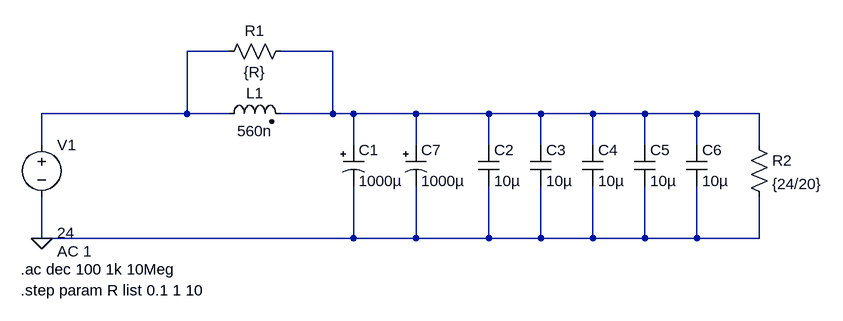
[diagram p0: schematic Output_FLT.asc]
Output_FLT.asc, the LTspice schematic file:
Version 4
SHEET 1 1068 680
WIRE 128 -80 64 -80
WIRE 288 -80 208 -80
WIRE 64 16 64 -80
WIRE 64 16 -160 16
WIRE 128 16 64 16
WIRE 288 16 288 -80
WIRE 288 16 208 16
WIRE 320 16 288 16
WIRE 416 16 320 16
WIRE 528 16 416 16
WIRE 608 16 528 16
WIRE 688 16 608 16
WIRE 768 16 688 16
WIRE 848 16 768 16
WIRE 944 16 848 16
WIRE -160 64 -160 16
WIRE 320 64 320 16
WIRE 416 64 416 16
WIRE 528 64 528 16
WIRE 608 64 608 16
WIRE 688 64 688 16
WIRE 768 64 768 16
WIRE 848 64 848 16
WIRE 944 64 944 16
WIRE -160 208 -160 144
WIRE 320 208 320 128
WIRE 320 208 -160 208
WIRE 416 208 416 128
WIRE 416 208 320 208
WIRE 528 208 528 128
WIRE 528 208 416 208
WIRE 608 208 608 128
WIRE 608 208 528 208
WIRE 688 208 688 128
WIRE 688 208 608 208
WIRE 768 208 768 128
WIRE 768 208 688 208
WIRE 848 208 848 128
WIRE 848 208 768 208
WIRE 944 208 944 144
WIRE 944 208 848 208
FLAG -160 208 0
SYMBOL voltage -160 48 R0
WINDOW 3 24 152 Left 2
WINDOW 123 24 180 Left 2
WINDOW 39 0 0 Left 0
SYMATTR Value 24
SYMATTR Value2 AC 1
SYMATTR InstName V1
SYMBOL ind2 112 32 R270
WINDOW 0 32 56 VTop 2
WINDOW 3 5 56 VBottom 2
SYMATTR InstName L1
SYMATTR Value 560n
SYMATTR Type ind
SYMATTR SpiceLine Ipk=23.5 Rser=0.0017 Rpar=327.9 Cpar=4.14p mfg="Würth Elektronik" pn="7843330056 WE-CHSA 1011"
SYMBOL res 112 -64 R270
WINDOW 0 32 56 VTop 2
WINDOW 3 0 56 VBottom 2
SYMATTR InstName R1
SYMATTR Value {R}
SYMBOL res 928 48 R0
SYMATTR InstName R2
SYMATTR Value {24/20}
SYMBOL polcap 304 64 R0
WINDOW 3 24 56 Left 2
SYMATTR InstName C1
SYMATTR Value 1000µ
SYMATTR Description Capacitor
SYMATTR Type cap
SYMATTR SpiceLine V=63 Irms=2.5 Rser=0.0297 Lser=16.4n mfg="Würth Elektronik" pn="860040780017 WCAP-ATUL 16x35,5" type="Al electrolytic"
SYMBOL cap 512 64 R0
SYMATTR InstName C2
SYMATTR Value 10µ
SYMATTR SpiceLine V=50 Rser=39m
SYMBOL cap 592 64 R0
SYMATTR InstName C3
SYMATTR Value 10µ
SYMATTR SpiceLine V=50 Rser=39m
SYMBOL cap 672 64 R0
SYMATTR InstName C4
SYMATTR Value 10µ
SYMATTR SpiceLine V=50 Rser=39m
SYMBOL cap 752 64 R0
SYMATTR InstName C5
SYMATTR Value 10µ
SYMATTR SpiceLine V=50 Rser=39m
SYMBOL cap 832 64 R0
SYMATTR InstName C6
SYMATTR Value 10µ
SYMATTR SpiceLine V=50 Rser=39m
SYMBOL polcap 400 64 R0
WINDOW 3 24 56 Left 2
SYMATTR InstName C7
SYMATTR Value 1000µ
SYMATTR Description Capacitor
SYMATTR Type cap
SYMATTR SpiceLine V=63 Irms=2.5 Rser=0.0297 Lser=16.4n mfg="Würth Elektronik" pn="860040780017 WCAP-ATUL 16x35,5" type="Al electrolytic"
TEXT -192 288 Left 2 !.step param R list 0.1 1 10
TEXT -192 256 Left 2 !.ac dec 100 1k 10Meg

The netlist it stands for:
* Output_FLT.asc
V1 N001 0 24 AC 1
L1 N001 N002 560n Ipk=23.5 Rser=0.0017 Rpar=327.9 Cpar=4.14p mfg="Würth Elektronik" pn="7843330056 WE-CHSA 1011"
R1 N001 N002 {R}
R2 N002 0 {24/20}
C1 N002 0 1000µ V=63 Irms=2.5 Rser=0.0297 Lser=16.4n mfg="Würth Elektronik" pn="860040780017 WCAP-ATUL 16x35,5" type="Al electrolytic"
C2 N002 0 10µ V=50 Rser=39m
C3 N002 0 10µ V=50 Rser=39m
C4 N002 0 10µ V=50 Rser=39m
C5 N002 0 10µ V=50 Rser=39m
C6 N002 0 10µ V=50 Rser=39m
C7 N002 0 1000µ V=63 Irms=2.5 Rser=0.0297 Lser=16.4n mfg="Würth Elektronik" pn="860040780017 WCAP-ATUL 16x35,5" type="Al electrolytic"
.step param R list 0.1 1 10
.ac dec 100 1k 10Meg
.backanno
.end